# EasyEDA Pro project ProPrj_DRV8701E直流有刷电机驱动_2025-06.epro

# Schematic Schematic1_1
Create Date: 2024-08-03; Page Name: P1; Project Name: DRV8701E直流有刷电机驱动; Schematic Name: Schematic1_1; Update Date: 2024-08-03; Drawed: 孟德晗
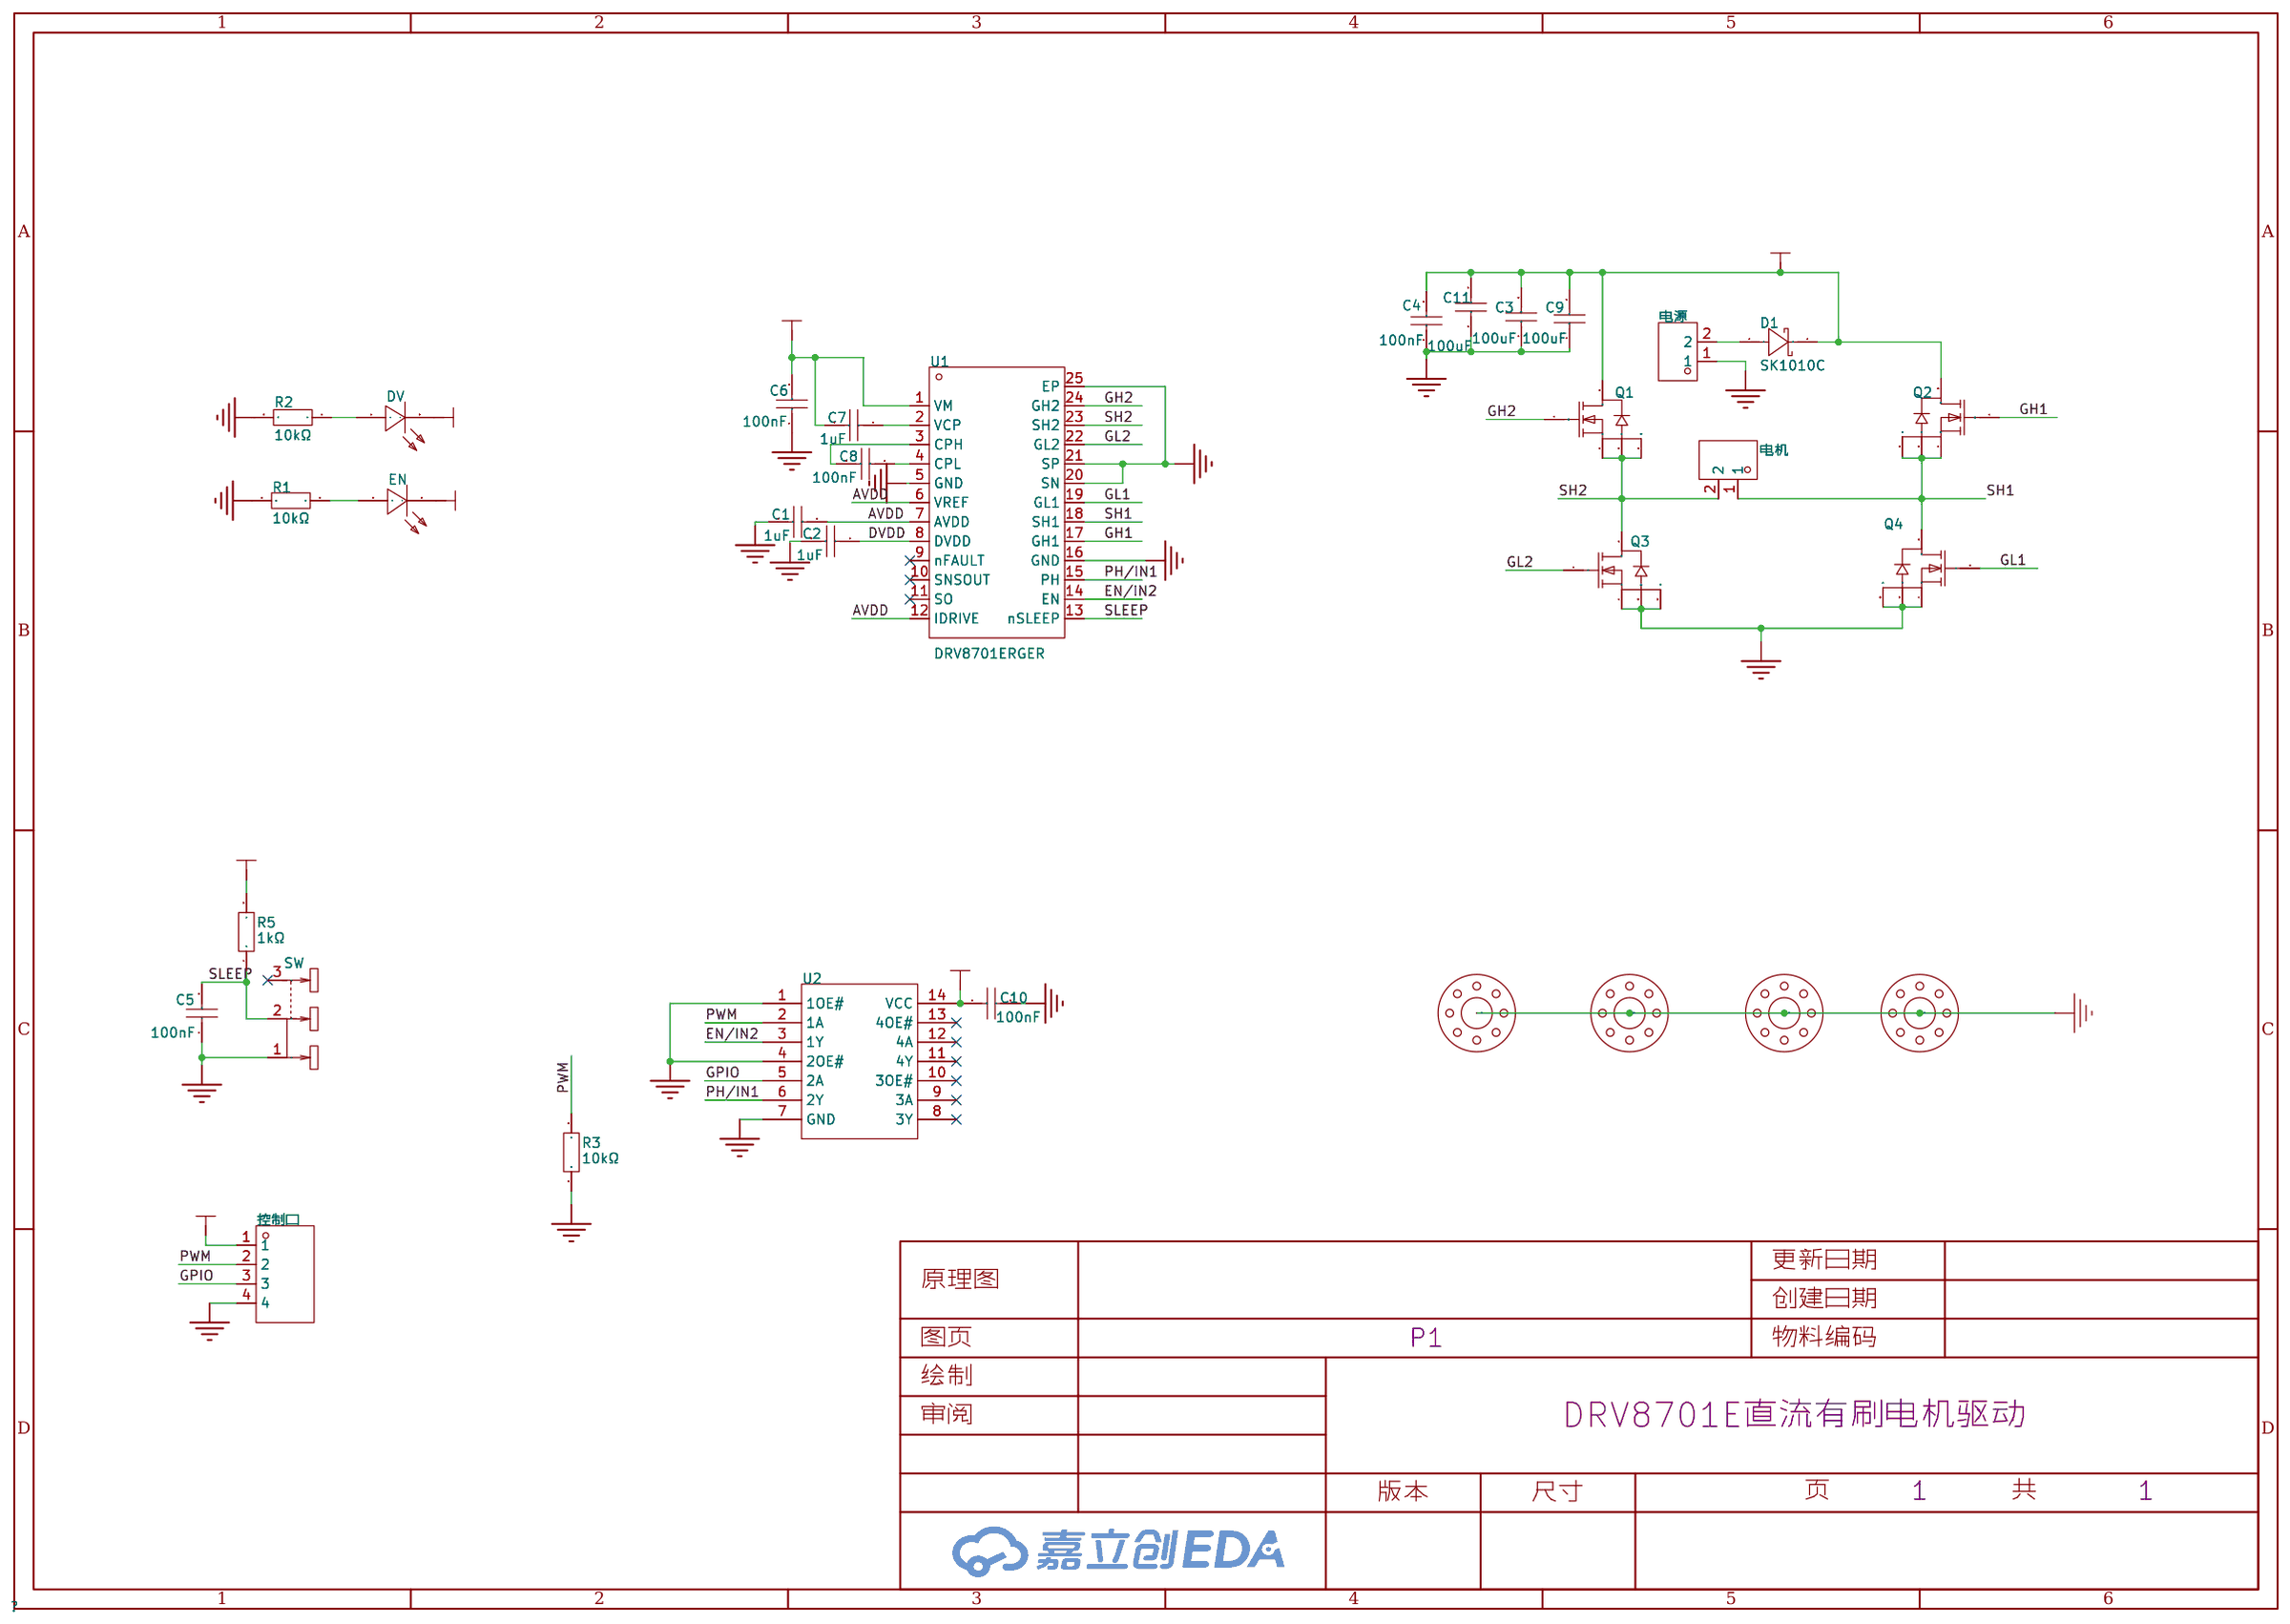
[diagram p0: schematic sheet]

## Parts
C1  1uF  [C0805]
C2  1uF  [C0805]
C3  100uF  [C0805]
C4  100nF  [C0805]
C5  100nF  [C0805]
C6  100nF  [C0805]
C7  1uF  [C0805]
C8  100nF  [C0805]
C9  100uF  [C0805]
C10  100nF  [C0805]
C11  100uF  [C0805]
D1  SK1010C  [SMC_L6.9-W5.9-LS7.9-RD]
DV  NCD0805R1  [LED0805-R-RD]
EN  NCD0805R1  [LED0805-R-RD]
I1  POSITION  [定位孔]
I2  POSITION  [定位孔]
I3  POSITION  [定位孔]
I4  POSITION  [定位孔]
Q1  TPH1R403NL  [TDSON-8_L5.9-W5.2-P1.27-BL]
Q2  TPH1R403NL  [TDSON-8_L5.9-W5.2-P1.27-BL]
Q3  TPH1R403NL  [TDSON-8_L5.9-W5.2-P1.27-BL]
Q4  TPH1R403NL  [TDSON-8_L5.9-W5.2-P1.27-BL]
R1  10kΩ  [R0805]
R2  10kΩ  [R0805]
R3  10kΩ  [R0805]
R5  1kΩ  [R0805]
SW  SS-12D10L5  [SW-TH_SS-12D10L5]
U1  DRV8701ERGER  [VQFN-24_L4.0-W4.0-P0.50-BL-EP2.5]
U2  74HC125PW,118  [TSSOP-14_L5.0-W4.4-P0.65-LS6.4-BL]
控制口  S4B-PH-K-S(LF)(SN)  [CONN-TH_4P-P2.00_S4B-PH-K-S-LF-SN]
电机  DB302-5.0-2P-GN-S  [CONN-TH_DB302-5.0-2P]
电源  DB302-5.0-2P-GN-S  [CONN-TH_DB302-5.0-2P]

## Library data of the parts
C1 C2 C7 = CL21B105KBFNNNE: 容值:1uF;精度:±10%;额定电压:50V;材质(温度系数):X7R;; LCSC Part Name: 1uF ±10% 50V; Supplier Part: C28323; Manufacturer: SAMSUNG(三星); Supplier Footprint: 0805; JLCPCB Part Class: Basic Part; Datasheet: https://atta.szlcsc.com/upload/public/pdf/source/20160218/1457707763339.pdf; Supplier: LCSC; Tolerance: ±10%; Voltage Rated: 50V; Temperature Coefficient: X7R
C3 C9 C11 = GRM21BR60J107ME15L: 容值:100uF;精度:±20%;额定电压:6.3V;材质(温度系数):X5R;; LCSC Part Name: 100uF ±20% 6.3V; Supplier Part: C141660; Manufacturer: muRata(村田); Supplier Footprint: 0805; JLCPCB Part Class: 扩展库; Datasheet: https://atta.szlcsc.com/upload/public/pdf/source/20171113/C141660_15105613320671115822.pdf; Supplier: LCSC; Tolerance: ±20%; Voltage Rated: 6.3V; Temperature Coefficient: X5R
C4-C6 C8 C10 = CC0805KRX7R9BB104: 容值:100nF;精度:±10%;额定电压:50V;材质(温度系数):X7R;; LCSC Part Name: 100nF ±10% 50V; Supplier Part: C49678; Manufacturer: YAGEO(国巨); Supplier Footprint: 0805; JLCPCB Part Class: 基础库; Datasheet: https://atta.szlcsc.com/upload/public/pdf/source/20180224/C181747_15194369449651363981.pdf; Supplier: LCSC; Tolerance: ±10%; Voltage Rated: 50V; Temperature Coefficient: X7R
D1 = SK1010C_C18199193: 二极管配置:独立式;正向压降(Vf):850mV@10A;直流反向耐压(Vr):100V;平均整流电流(Io):10A;; LCSC Part Name: 电压:100V 电流:10A; Supplier Part: C18199193; Manufacturer: 宏迦橙; Supplier Footprint: SMC; JLCPCB Part Class: 扩展库; Datasheet: https://atta.szlcsc.com/upload/public/pdf/source/20230925/90F2340DC9BC2B2517F18AABBBD1A464.pdf; Supplier: LCSC; Diode Configuration: 独立式; Forward Voltage (Vf@If): 850mV@10A; Reverse Voltage (Vr): 100V; Average Rectified Current (Io): 10A; Reverse Leakage Current (Ir): 50uA@100V
DV EN = NCD0805R1: 灯头类型:-;发光颜色:红色;正向电压(VF):1.6V~2.6V;功率:65mW;正向电流:20mA;主波长:615nm~630nm;二极管配置:独立二极管;透镜颜色:无色透明透镜;色温:-;发光强度:67mcd~195mcd;发光角度:130°;载带方式:-;工作温度:-30℃~+85℃;; Supplier Part: C84256; Manufacturer: 国星光电; Supplier Footprint: 0805; JLCPCB Part Class: 基础库; Datasheet: https://atta.szlcsc.com/upload/public/pdf/source/20200820/C84256_F0A75A43B3EAD75808600A0514C76B99.pdf; Supplier: LCSC; Emitted Color: 红色; Forward Voltage (VF): 1.6V~2.6V; Power Dissipation: 65mW; Forward Current: 20mA; Dominant Wavelength: 615nm~630nm; Diode Configuration: 独立二极管; Lens Color: 无色透明透镜; Luminous Intensity: 67mcd~195mcd; Viewing Angle: 130°; Operating Temperature: -30℃~+85℃
I1-I4 = POSITION: Library Name: My_house; Check: false
Q1-Q4 = TPH1R403NL_C19268167: Supplier Part: C19268167; Manufacturer: TECH PUBLIC(台舟); JLCPCB Part Class: 扩展库; Datasheet: https://atta.szlcsc.com/upload/public/pdf/source/20231201/E668D9B30DA1C5FDF2CA4EE637776407.pdf; Supplier: LCSC
R1-R3 = 0805W8F1002T5E_C17414: 电阻类型:厚膜电阻;阻值:10kΩ;精度:±1%;功率:125mW;最大工作电压:150V;温度系数:±100ppm/℃;; LCSC Part Name: 10kΩ ±1% 125mW 厚膜电阻; Supplier Part: C17414; Manufacturer: UNI-ROYAL(厚声); Manufacturer Part: 0805W8F1002T5E; Supplier Footprint: 0805; JLCPCB Part Class: 基础库; Datasheet: https://atta.szlcsc.com/upload/public/pdf/source/20200306/C422600_1E6D84923E4A46A82E41ADD87F860B5C.pdf; Supplier: LCSC; Type: 厚膜电阻; Tolerance: ±1%; Power(Watts): 125mW; Overload Voltage (Max): 150V; Temperature Coefficient: ±100ppm/℃; Operating Temperature Range: -55℃~+155℃
R5 = 0805W8F1001T5E: 电阻类型:厚膜电阻;阻值:1kΩ;精度:±1%;功率:125mW;最大工作电压:150V;温度系数:±100ppm/℃;; LCSC Part Name: 1kΩ ±1% 125mW 厚膜电阻; Supplier Part: C17513; Manufacturer: UNI-ROYAL(厚声); Supplier Footprint: 0805; JLCPCB Part Class: Basic Part; Datasheet: https://atta.szlcsc.com/upload/public/pdf/source/20200306/C422600_1E6D84923E4A46A82E41ADD87F860B5C.pdf; Supplier: LCSC; Type: 厚膜电阻; Tolerance: ±1%; Power(Watts): 125mW; Overload Voltage (Max): 150V; Temperature Coefficient: ±100ppm/℃; Operating Temperature Range: -55℃~+155℃
SW = SS-12D10L5: 电路结构:单刀双掷;安装方式:直插;开关颜色:黑色;额定电流(DC):3A;额定电压(DC):125V;额定电流(AC):3A;额定电压(AC):125V;机械寿命:1万次;; LCSC Part Name: 柄长5mm 直插双档 滑动开关; Supplier Part: C319012; Manufacturer: XKB Connectivity(中国星坤); Supplier Footprint: 插件; JLCPCB Part Class: 扩展库; Datasheet: https://atta.szlcsc.com/upload/public/pdf/source/20211009/D6412F37AABE6F9459A6EE7FA4DAEADB.pdf; Supplier: LCSC; Circuit: 单刀双掷; Actuator Style: 矩形柱状; Pin Style: PC引脚; Switch Length: 13mm; Switch Width: 6.8mm; Switch Height: 6.4mm; Mounting Style: 直插; Actuator Color: 黑色; Current Rating (DC): 3A; Voltage Rating (DC): 125V; Current Rating (AC): 3A; Voltage Rating (AC): 125V; Mechanical Life: 1万次; Operating Temperature: -40℃~+85℃
U1 = DRV8701ERGER: 驱动电机类型:有刷直流电机;电源电压:5.9V~45V;输出电流:-;接口:并行;; LCSC Part Name: 有刷直流电机驱动芯片 45V; Supplier Part: C90964; Manufacturer: TI(德州仪器); Supplier Footprint: VQFN-24-EP(4x4); JLCPCB Part Class: 扩展库; Datasheet: https://www.ti.com/cn/lit/gpn/drv8701; Supplier: LCSC; Drive motor type: 有刷直流电机; Supply Voltage: 5.9V~45V; Interface: 并行; Operating Temperature: -40℃~+125℃@(Ta)
U2 = 74HC125PW,118: 输入类型:-;电源电压:2V~6V;元件数:4;每个元件位数:1;灌电流(IOL):7.8mA;拉电流(IOH):7.8mA;; Supplier Part: C5599; Manufacturer: Nexperia(安世); Supplier Footprint: TSSOP-14; JLCPCB Part Class: 扩展库; Datasheet: https://atta.szlcsc.com/upload/public/pdf/source/20120402/1457706457985.pdf; Supplier: LCSC; output type: 三态; Supply Voltage: 2V~6V; Number of Elements: 4; Number of Bits per Element: 1; Sink Current: 7.8mA; Source Current: 7.8mA; Logic Family: 74HC; Operating Temperature: -40℃~+125℃
控制口 = S4B-PH-K-S(LF)(SN): 插针结构:1x4P;间距:2mm;安装方式:弯插;参考系列:PH;总PIN数:4P;排数:1;每排PIN数:4;行距:-;触头材质:黄铜;; LCSC Part Name: 系列:PH 间距:2mm 1x4P; Supplier Part: C157926; Manufacturer: JST; Supplier Footprint: 弯插,P=2mm; JLCPCB Part Class: 扩展库; Datasheet: https://atta.szlcsc.com/upload/public/pdf/source/20181010/C265101_22107ACC4D8714694FDA2DD97145FA81.pdf; Supplier: LCSC; Pins Structure: 1x4P; Pitch: 2mm; Mounting Style: 弯插; Reference Series: PH; Number of Pins: 4P; Number of Rows: 1; Number of PINs Per Row: 4; Contact Material: 黄铜
电机 电源 = DB302-5.0-2P-GN-S: LCSC Part Name: 2P P=5mm; Supplier Part: C2997275; Manufacturer: DORABO(地博电气); Supplier Footprint: P=5mm; JLCPCB Part Class: 扩展库; Datasheet: https://atta.szlcsc.com/upload/public/pdf/source/20230106/A45D323DD731C2F419E8C39F837CB85B.pdf; Supplier: LCSC

## Nets
3V3: C10.2 R5.2 U2.14(VCC) 控制口.1
AVDD: C1.2 U1.6(VREF) U1.7(AVDD) U1.12(IDRIVE)
DVDD: C2.1 U1.8(DVDD)
GND: C1.1 C2.2 C3.1 C4.1 C5.1 C6.1 C9.1 C10.1 C11.1 I1.0 I2.0 I3.0 I4.0 Q3.1(S) Q3.2(S) Q3.3(S) Q4.1(S) Q4.2(S) Q4.3(S) R1.2 R2.2 R3.2 SW.1 U1.5(GND) U1.16(GND) U1.20(SN) U1.21(SP) U1.25(EP) U2.1(1OE#) U2.4(2OE#) U2.7(GND) 控制口.4 电源.1
EN/IN2: U1.14(EN) U2.3(1Y)
GH1: Q2.4(G) U1.17(GH1)
GH2: Q1.4(G) U1.24(GH2)
GL1: Q4.4(G) U1.19(GL1)
GL2: Q3.4(G) U1.22(GL2)
GPIO: U2.5(2A) 控制口.3
PH/IN1: U1.15(PH) U2.6(2Y)
PWM: R3.1 U2.2(1A) 控制口.2
SH1: Q2.1(S) Q2.2(S) Q2.3(S) Q4.5(D) U1.18(SH1) 电机.1
SH2: Q1.1(S) Q1.2(S) Q1.3(S) Q3.5(D) U1.23(SH2) 电机.2
SLEEP: C5.2 EN.2(-) R5.1 SW.2 U1.13(nSLEEP)
VM: C3.2 C4.2 C6.2 C7.2 C9.2 C11.2 D1.1(K) DV.2(-) Q1.5(D) Q2.5(D) U1.1(VM)
$1N2000: DV.1(+) R2.1
$1N2003: EN.1(+) R1.1
$1N2141: C7.1 U1.2(VCP)
$1N2257: C8.2 U1.3(CPH)
$1N2265: C8.1 U1.4(CPL)
$1N5261: D1.2(A) 电源.2

Not connected (* = marked no-connect by the designer): SW 3*; U1 9(nFAULT)* 10(SNSOUT)* 11(SO)*; U2 8(3Y)* 9(3A)* 10(3OE#)* 11(4Y)* 12(4A)* 13(4OE#)*

# Board PCB1_1
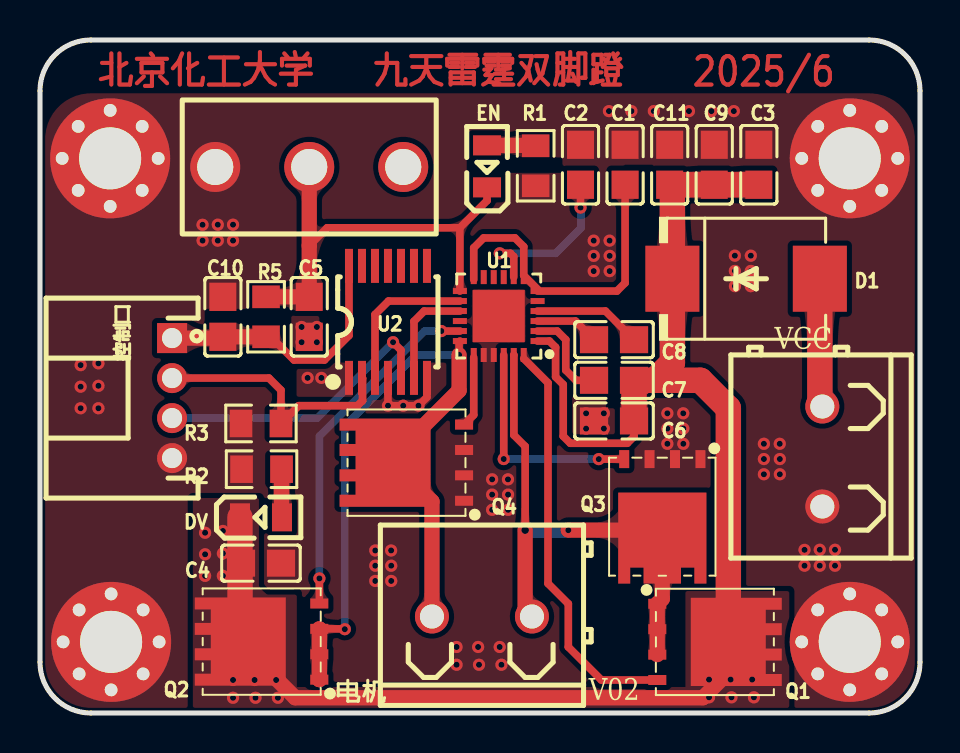
[diagram p1: board, top side]
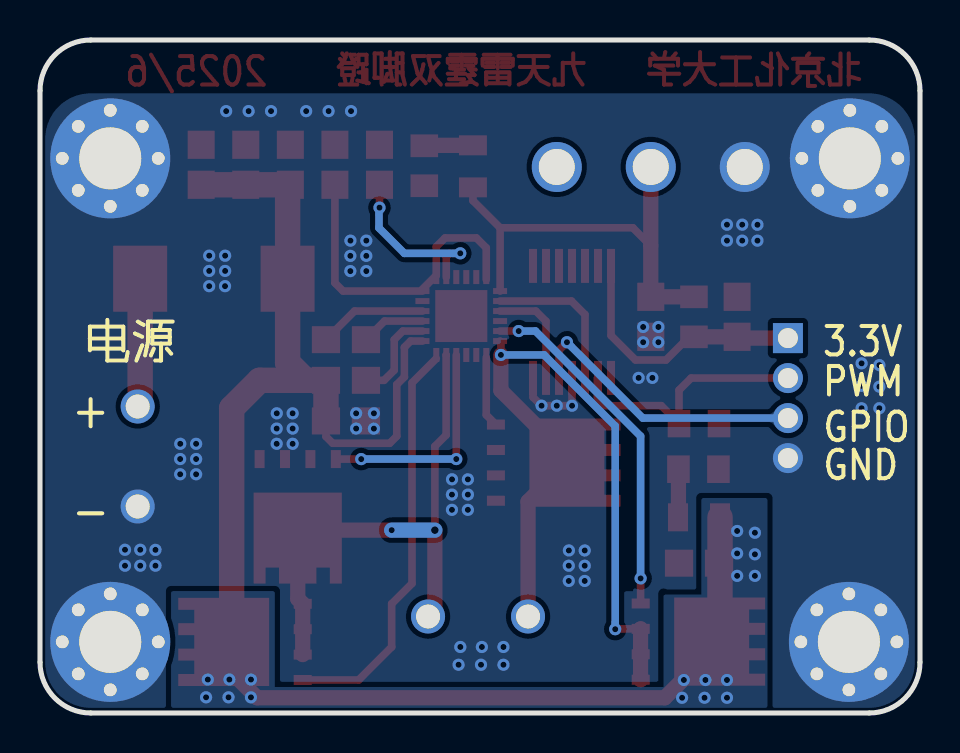
[diagram p2: board, bottom side, seen from below]

Outline 44 x 33.66 mm; copper layers: Top Layer, Bottom Layer. Coordinates in mm from the lower left corner of the outline.
Outline path: 0,31.11 0,2.54 arc(0.74,0.74) 2.54,0 41.46,0 arc(43.26,0.74) 44,2.54 44,31.11 arc(43.26,32.91) 41.46,33.66 2.54,33.66 arc(0.74,32.91) 0,31.11
Stack: Top Layer 0.035mm / Dielectric1 1.51mm FR4 er 4.5 / Bottom Layer 0.035mm

## Design rules (mm)
template: 自定义配置
spacing copperThickness1oz (default): track to track 0.102, other pairs 0.152 to 0.3
spacing copperThickness2oz: track to track 0.203, other pairs 0.152 to 0.3
track width copperThickness1oz (default): min 0.127, default 0.254, max 2.54
track width copperThickness2oz: min 0.203, default 0.254, max 2.54
differential pair differentialPair (default): width min 0.127, default 0.254, max 2.54; gap min 0.152, default 0.152
via viaSize (default): diameter min 0.5, default 0.61, max 10; hole min 0.3, default 0.305, max 6.3

## Placement (name value [footprint] x y rotation side)
C1  1uF  [C0805]  29.25 27.42 270 top
C2  1uF  [C0805]  27.03 27.42 90 top
C3  100uF  [C0805]  35.94 27.42 270 top
C4  100nF  [C0805]  11.05 7.49 180 top
C5  100nF  [C0805]  13.46 19.81 90 top
C6  100nF  [C0805]  28.7 14.61 0 top
C7  1uF  [C0805]  28.7 16.64 0 top
C8  100nF  [C0805]  28.7 18.67 180 top
C9  100uF  [C0805]  33.71 27.42 270 top
C10  100nF  [C0805]  9.14 19.81 270 top
C11  100uF  [C0805]  31.48 27.42 270 top
D1  SK1010C  [SMC_L6.9-W5.9-LS7.9-RD]  35.31 21.72 0 top
DV  NCD0805R1  [LED0805-R-RD]  11.05 9.79 0 top
EN  NCD0805R1  [LED0805-R-RD]  22.35 27.34 90 top
I1  POSITION  [定位孔]  3.56 3.56 0 top
I2  POSITION  [定位孔]  40.49 3.56 0 top
I3  POSITION  [定位孔]  3.51 27.74 0 top
I4  POSITION  [定位孔]  40.49 27.74 0 top
Q1  TPH1R403NL  [TDSON-8_L5.9-W5.2-P1.27-BL]  32.64 3.56 270 top
Q2  TPH1R403NL  [TDSON-8_L5.9-W5.2-P1.27-BL]  12.19 3.57 90 top
Q3  TPH1R403NL  [TDSON-8_L5.9-W5.2-P1.27-BL]  31.12 10.92 180 top
Q4  TPH1R403NL  [TDSON-8_L5.9-W5.2-P1.27-BL]  19.43 12.52 90 top
R1  10kΩ  [R0805]  24.78 27.36 270 top
R2  10kΩ  [R0805]  11.08 12.19 180 top
R3  10kΩ  [R0805]  11.05 14.48 180 top
R5  1kΩ  [R0805]  11.3 19.81 270 top
SW  SS-12D10L5  [SW-TH_SS-12D10L5]  13.46 27.31 0 top
U1  DRV8701ERGER  [VQFN-24_L4.0-W4.0-P0.50-BL-EP2.5]  22.94 19.85 90 top
U2  74HC125PW,118  [TSSOP-14_L5.0-W4.4-P0.65-LS6.4-BL]  17.4 19.56 0 top
控制口  S4B-PH-K-S(LF)(SN)  [CONN-TH_4P-P2.00_S4B-PH-K-S-LF-SN]  6.6 15.75 270 top
电机  DB302-5.0-2P-GN-S  [CONN-TH_DB302-5.0-2P]  22.1 4.83 0 top
电源  DB302-5.0-2P-GN-S  [CONN-TH_DB302-5.0-2P]  39.12 12.83 90 top

## Footprints (pads in the part's own frame, mm; a bottom-side part is the same pattern mirrored in y, then rotated)
C0805
  rect 1.41x1.35 smd: 1(-1,0) 2(1,0)
CONN-TH_4P-P2.00_S4B-PH-K-S-LF-SN
  rect 1.5x1.5 hole 1: 1(-3,0)
  round 1.5 hole 1: 2(-1,0) 3(1,0) 4(3,0)
CONN-TH_DB302-5.0-2P
  round 1.7 hole 1.2: 1(-2.5,0) 2(2.5,0)
LED0805-R-RD
  rect 1x1.399 smd: 1(1.05,0) 2(-1.05,0)
R0805
  rect 1.133x1.377 smd: 1(-1,0) 2(1,0)
SMC_L6.9-W5.9-LS7.9-RD
  rect 2.7x3.3 smd: 1(-3.687,0) 2(3.687,0)
SW-TH_SS-12D10L5
  round 2.5 hole 1.8: 1(-4.7,0) 2(0,0) 3(4.7,0)
TDSON-8_L5.9-W5.2-P1.27-BL
  rect 0.5x0.9 smd: 1(-1.905,-1.775) 2(-0.635,-1.775) 3(0.635,-1.775) 4(1.905,-1.775)
  custom 4.41x4.55 smd: 5(0,1.775)
TSSOP-14_L5.0-W4.4-P0.65-LS6.4-BL
  rect 0.4x1.7 smd: 1(-1.95,-2.8) 2(-1.3,-2.8) 3(-0.65,-2.8) 4(0,-2.8) 5(0.65,-2.8) 6(1.3,-2.8) 7(1.95,-2.8) 8(1.95,2.8) 9(1.3,2.8) 10(0.65,2.8) 11(0,2.8) 12(-0.65,2.8) 13(-1.3,2.8) 14(-1.95,2.8)
VQFN-24_L4.0-W4.0-P0.50-BL-EP2.5
  rect 0.3x0.7 smd: 1(-1.25,-1.942) 2(-0.75,-1.942) 3(-0.25,-1.942) 4(0.25,-1.942) 5(0.75,-1.942) 6(1.25,-1.942) 13(1.25,1.942) 14(0.75,1.942) 15(0.25,1.942) 16(-0.25,1.942) 17(-0.75,1.942) 18(-1.25,1.942)
  rect 0.7x0.3 smd: 7(1.948,-1.25) 8(1.948,-0.75) 9(1.948,-0.25) 10(1.948,0.25) 11(1.948,0.75) 12(1.948,1.25) 19(-1.948,1.25) 20(-1.948,0.75) 21(-1.948,0.25) 22(-1.948,-0.25) 23(-1.948,-0.75) 24(-1.948,-1.25)
  rect 2.6x2.6 smd: 25(0.001,-0.001)
定位孔
  round 0.635 hole 0.635: 1(-2.4,0) 1(-1.6,1.6) 1(-1.6,-1.6) 1(0,2.4) 1(0,-2.4) 1(1.6,1.6) 1(1.6,-1.6) 1(2.4,0)
  round 6 hole 3.1: 1(0,0)

## Nets
As in the schematic, except:
GND: C1.1 C2.2 C3.1 C4.1 C5.1 C6.1 C9.1 C10.1 C11.1 I1.1 I2.1 I3.1 I4.1 Q3.1 Q3.2 Q3.3 Q4.1 Q4.2 Q4.3 R1.2 R2.2 R3.2 SW.1 U1.5 U1.16 U1.20 U1.21 U1.25 U2.1 U2.4 U2.7 控制口.4 电源.1

Pads without a net: SW 3; U1 9 10 11; U2 8 9 10 11 12 13

## Via types
v1: diameter 0.61, hole 0.305, Top Layer to Bottom Layer, 107 vias
v2: diameter 0.61, hole 0.381, Top Layer to Bottom Layer, 1 via

## Routing (per net, layer and track width the routed paths; a pad name or vN(x,y) marks a point on that pad's centre or on a via; arc(x,y) is an arc through that point)
3V3: length 13.2
  Top Layer w0.381: R5.2 11.54,18.81 12.7,17.65 14.22,17.65 15.45,18.88 U2.14
  Top Layer w0.762: 控制口.1 9.08,18.75 C10.2 11.18,18.81
AVDD: length 16.3
  Top Layer w0.381: U1.6 28.85,21.1 29.25,21.51 C1.2 ; 21.69,21.67 21.69,23.26 22.18,23.76 23.75,23.76 24.19,23.32 24.19,21.88 24.88,21.19
DVDD: length 8.6
  Top Layer w0.381: C2.1 v1(27.03,25.27) ; v1(22.99,22.99) 23.53,22.99 23.69,22.83 23.69,21.8
  Bottom Layer w0.381: v1(22.99,22.99) 25.78,22.99 27.05,24.26 27.05,25.25 v1(27.03,25.27)
GND: length 4.5
  Top Layer w0.381: U2.4 v1(17.4,15.37) v1(18.16,15.37) v1(18.92,15.37) 19.35,15.79 U2.7
  vias: v1(2.03,17.4) v1(2.03,16.32) v1(2.03,15.24) v1(2.92,17.48) v1(2.92,16.36) v1(2.92,15.24) v1(8.13,24.41) v1(8.13,23.62) v1(8.89,24.42) v1(8.89,23.62) v1(9.65,24.42) v1(9.65,23.62) v1(13.08,19.3) v1(13.08,18.54) v1(13.38,16.76) v1(13.84,19.3) v1(13.84,18.54) v1(14.07,16.76) v1(16.76,8.13) v1(16.76,7.37) v1(16.76,6.6) v1(17.56,8.13) v1(17.56,7.37) v1(17.56,6.6) v1(20.83,3.3) v1(20.83,2.41) v1(21.91,3.3) v1(21.95,2.41) v1(22.61,11.68) v1(22.61,10.92) v1(22.61,10.16) v1(22.98,3.3) v1(23.07,2.41) v1(23.4,11.68) v1(23.4,10.92) v1(23.4,10.16) v1(27.31,14.99) v1(27.31,14.22) v1(27.69,23.62) v1(27.69,22.86) v1(27.69,22.1) v1(28.19,14.99) v1(28.19,14.22) v1(28.45,30.1) v1(28.48,23.62) v1(28.48,22.86) v1(28.48,22.1) v1(29.57,30.1) v1(30.69,30.1) v1(31.37,14.99) v1(31.37,14.22) v1(31.37,13.46) v1(32.16,14.99) v1(32.17,14.22) v1(32.17,13.46) v1(32.45,30.1) v1(33.57,30.1) v1(34.69,30.1) v1(34.74,22.87) v1(34.74,22.11) v1(34.75,21.34) v1(35.54,22.87) v1(35.54,22.11) v1(35.54,21.34) v1(36.19,13.46) v1(36.19,12.7) v1(36.19,11.94) v1(36.99,13.46) v1(36.99,12.7) v1(36.99,11.94) v1(38.23,8.16) v1(38.23,7.37) v1(38.99,8.16) v1(38.99,7.37) v1(39.75,8.16) v1(39.75,7.37)
EN/IN2: length 7.7
  Top Layer w0.381: U2.3 16.75,19.92 17.43,20.6 U1.14
GH1: length 17.6
  Top Layer w0.381: 13.97,5.48 13.97,5.48 v1(13.97,6.73) ; U1.17 v1(20.07,19.1)
  Bottom Layer w0.381: v1(20.07,19.1) 19.23,19.1 13.97,13.84 v1(13.97,6.73)
GH2: length 20.3
  Top Layer w0.381: 30.73,1.65 28.07,1.65 26.42,3.3 26.42,5.46 25.4,6.48 25.4,16.51 24.19,17.72
GL1: length 3.6
  Top Layer w0.381: 21.69,17.78 21.69,14.91 Q4.4
GL2: length 11.2
  Top Layer w0.381: Q3.4 v1(27.94,12.7) ; U1.22 v1(23.19,12.7)
  Bottom Layer w0.381: v1(27.94,12.7) 27.94,12.7 v1(23.19,12.7)
GPIO: length 14.6
  Top Layer w0.381: U2.5 18.05,18.15 v1(17.65,18.54)
  Bottom Layer w0.381: 控制口.3 13.86,14.75 v1(17.65,18.54)
PH/IN1: length 5.3
  Top Layer w0.381: U1.15 19.21,20.1 18.7,19.59 U2.6
PWM: length 13.1
  Top Layer w0.381: U2.2 16.13,16.73 16.13,15.62 15.88,15.37 12.94,15.37 R3.1 12.05,16.14 11.45,16.75 控制口.2
SH1: length 37.1
  Top Layer w0.381: U1.18 20.96,18.56 v1(20.96,17.91) ; Q2.3 15.22,4.21 v1(15.24,4.19)
  Top Layer w0.762: Q2.1 13.97,1.67 13.97,4.2 Q2.3 ; v1(20.96,17.91) 20.96,16.13 17.65,12.83 Q4.5 19.6,10.57 电机.1
  Bottom Layer w0.381: v1(15.24,4.19) 15.24,14.35 18.8,17.91 v1(20.96,17.91)
SH2: length 26.6
  Top Layer w0.381: 31.11,9.14 31.12,9.15 ; v2(24.26,9.14) 24.26,13.33 23.69,13.9 23.69,17.89 U1.23
  Top Layer w0.762: Q1.3 Q1.2 Q1.1 31.11,5.71 31.11,9.14 v1(26.42,9.14) ; v2(24.26,9.14) 24.26,5.17 电机.2
  Bottom Layer w0.762: v2(24.26,9.14) v1(26.42,9.14)
SLEEP: length 22.3
  Top Layer w0.381: 21,24.26 U1.13 ; 21,24.26 22.35,25.62 EN.2 ; 21,24.26 14.36,24.26 13.46,23.37
  Top Layer w0.762: SW.2 C5.2 R5.1
VM: length 78.1
  Top Layer w0.381: C6.2 29.7,13.83 29.37,13.49 26.51,13.49 26.16,13.84 26.16,16.42 25.78,16.81 25.78,18.29 25.47,18.6 U1.1
  Top Layer w0.762: 10,3.52 11.81,1.71 12.76,0.76 33.15,0.76 34.41,2.03 Q1.5
  Top Layer w1.27: Q1.5 34.42,3.56 34.42,15.24 33.02,16.64 30.73,16.64 ; C6.2 C7.2 30.73,16.64 ; 30.73,16.64 31.62,17.52 D1.1 31.62,26.28 C11.2 C9.2 C3.2 ; 10.02,3.19 10,3.21 10,7.37 10,7.37 DV.2
  vias: v1(8.25,9.01) v1(8.25,7.94) v1(8.25,6.86) v1(9.14,9.1) v1(9.14,7.98) v1(9.14,6.86) v1(9.65,1.65) v1(9.65,0.76) v1(10.73,1.65) v1(10.77,0.76) v1(11.81,1.65) v1(11.9,0.76) v1(33.45,1.67) v1(33.45,0.78) v1(34.53,1.67) v1(34.57,0.78) v1(35.61,1.67) v1(35.7,0.78)
$1N2000: length 2.4
  Top Layer w0.762: DV.1 12.08,9.81 R2.1
$1N2003: length 2.4
  Top Layer w0.762: R1.1 24.76,28.39 EN.1
$1N2141: length 4.7
  Top Layer w0.381: U1.2 25.86,19.1 26.29,18.67 26.29,17.14 26.8,16.64 C7.1
$1N2257: length 3.2
  Top Layer w0.381: U1.3 26.77,19.6 C8.2
$1N2265: length 5.4
  Top Layer w0.381: C8.1 28.27,20.1 U1.4
$1N5261: length 6.4
  Top Layer w1.27: D1.2 38.99,15.45 电源.2

## Copper pours and planes (outline as drawn; the poured copper is in the pictures)
GND on Top Layer: 0,31.24 44.07,31.24 44.07,-0.13 0,-0.13
GND on Bottom Layer: 0,31.24 43.81,31.24 43.81,0 0,0
VM on Top Layer: 10.95,10.75 10.95,5.92 12.79,5.92 12.84,5.97 12.84,1.3 32.27,1.3 32.27,6.1 37.46,6.1 37.46,0.02 37.48,0 7.64,0 7.64,10.75
VM on Bottom Layer: 10.93,10.75 10.93,5.92 12.78,5.92 12.83,5.97 12.83,1.3 32.26,1.3 32.26,6.1 37.45,6.1 37.45,0.02 37.47,0 7.63,0 7.63,10.75

Small or netless copper shapes (teardrops, artwork), in the pictures only: 87 on Top Layer, 10 on Bottom Layer

## Text on the board
Bottom Silkscreen Layer: GPIO | GND | 3.3V | PWM | + | - | 电源
Top Layer: 2025/6 | 北京化工大学 | 九天雷霆双脚蹬
Top Silkscreen Layer: V02 | VCC
